# Altium schematic sheet Sch2.SchDoc
size A4; SheetNumber: 2; SheetTotal: 5
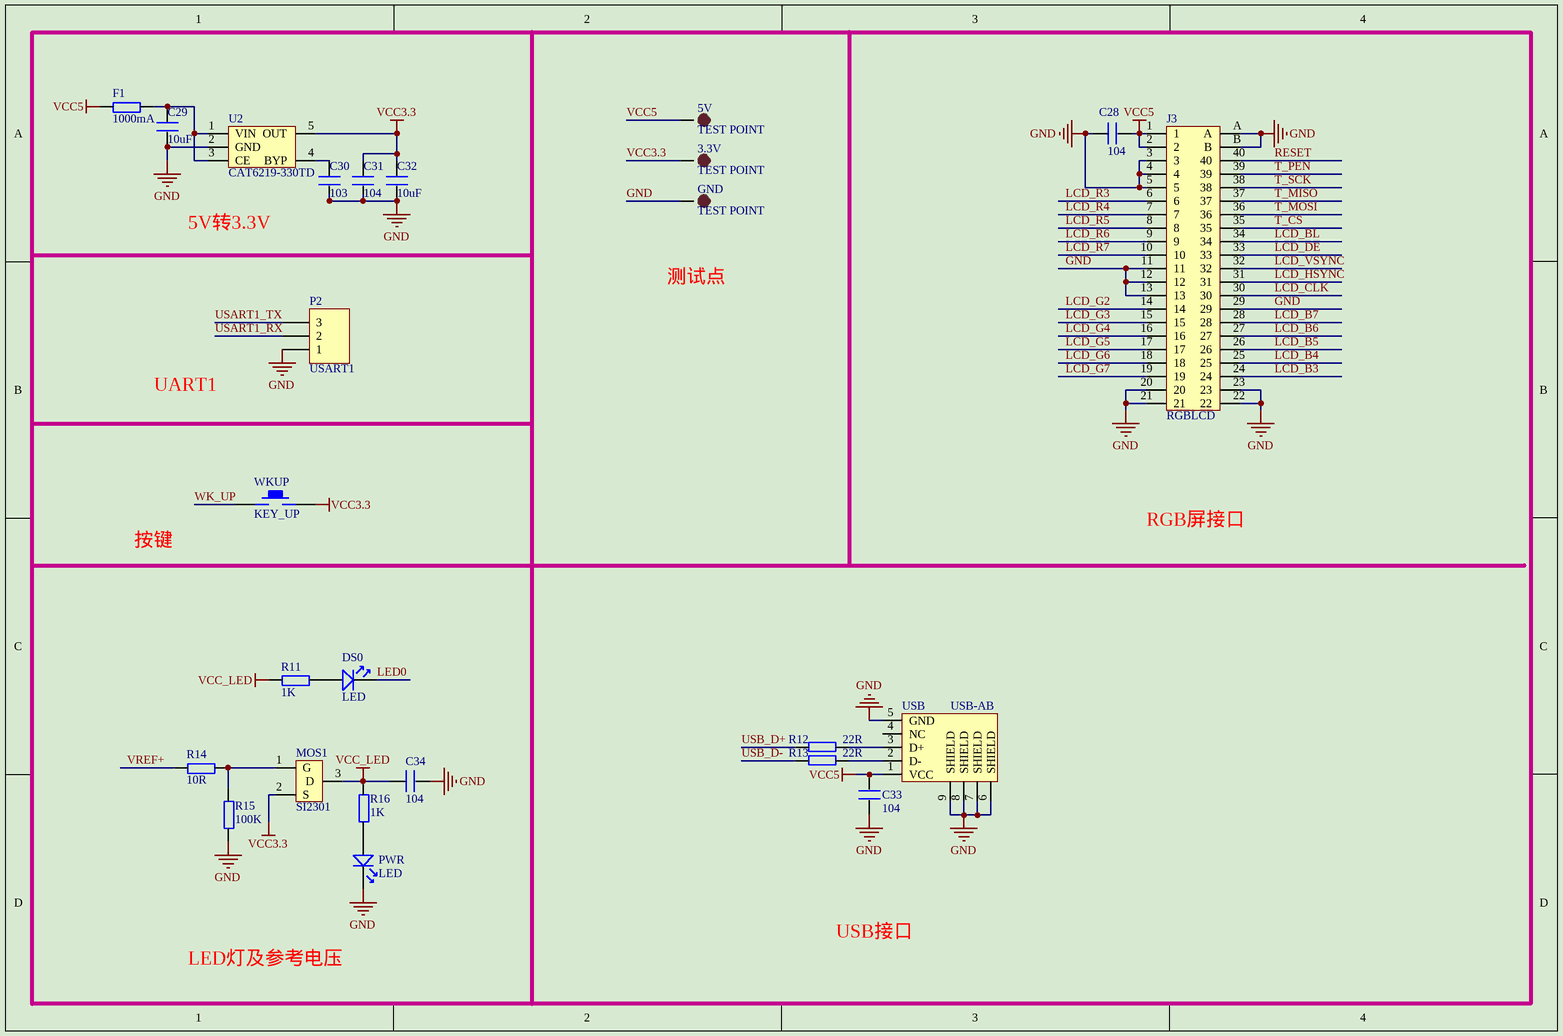
[diagram p0: Sch2.SchDoc]

## Parts
3.3V  TEST POINT  [TP-1.5]
5V  TEST POINT  [TP-1.5]
C28  104  [0402]
C29  10uF  [0603P]
C30  103  [0402]
C31  104  [0402]
C32  10uF  [0603P]
C33  104  [0402]
C34  104  [0402]
DS0  LED  [SMDLED-0603]
F1  1000mA  [0805]
GND  TEST POINT  [TP-1.5]
J3  RGBLCD  [FPC-TOP40]
MOS1  SI2301  [SO-G3/C2.5]
P2  USART1  [HDR1X3]
PWR  LED  [SMDLED-0603]
R11  1K  [0402]
R12  22R  [0402]
R13  22R  [0402]
R14  10R  [0402]
R15  100K  [0402]
R16  1K  [0402]
U2  CAT6219-330TD  [SOT-23-5]
USB  USB-AB  [USB_AB]
WKUP  KEY_UP  [KEY_SOP3625]

## Nets
GND: C28.2 C29.1 C30.1 C31.1 C32.1 C33.2 C34.1 GND.1 J3.3 J3.4 J3.5 J3.11 J3.12 J3.13 J3.20 J3.21 J3.22 J3.23 J3.29 J3.A J3.B P2.1 PWR.2 R15.1 U2.2(GND) USB.5(GND) USB.6(SHIELD) USB.7(SHIELD) USB.8(SHIELD) USB.9(SHIELD)
VCC3.3: 3.3V.1 C31.2 C32.2 MOS1.2(S) U2.5(OUT) WKUP.2
VCC5: 5V.1 C28.1 C33.1 F1.1 J3.1 J3.2 USB.1(VCC)
VCC_LED: C34.2 MOS1.3(D) R11.1 R16.2
LCD_B3: J3.24
LCD_B4: J3.25
LCD_B5: J3.26
LCD_B6: J3.27
LCD_B7: J3.28
LCD_BL: J3.34
LCD_CLK: J3.30
LCD_DE: J3.33
LCD_G2: J3.14
LCD_G3: J3.15
LCD_G4: J3.16
LCD_G5: J3.17
LCD_G6: J3.18
LCD_G7: J3.19
LCD_HSYNC: J3.31
LCD_R3: J3.6
LCD_R4: J3.7
LCD_R5: J3.8
LCD_R6: J3.9
LCD_R7: J3.10
LCD_VSYNC: J3.32
LED0: DS0.2
RESET: J3.40
T_CS: J3.35
T_MISO: J3.37
T_MOSI: J3.36
T_PEN: J3.39
T_SCK: J3.38
USART1_RX: P2.2
USART1_TX: P2.3
USB_D+: R12.2
USB_D-: R13.2
VREF+: R14.1
WK_UP: WKUP.1
NetC29_2: C29.2 F1.2 U2.1(VIN) U2.3(CE)
NetC30_2: C30.2 U2.4(BYP)
NetDS0_1: DS0.1 R11.2
NetMOS1_1: MOS1.1(G) R14.2 R15.2
NetPWR_1: PWR.1 R16.1
NetR12_1: R12.1 USB.3(D+)
NetR13_1: R13.1 USB.2(D-)

Not connected (* = marked no-connect by the designer): USB 4(NC)

## Notes on the sheet
- 5V转3.3V
- 测试点
- UART1
- 按键
- RGB屏接口
- LED灯及参考电压
- USB接口

## Library data of the parts
3.3V 5V GND = TEST-POINT: 测试点
C28-C34 = C
F1 R11-R16 = R
J3 = FPC-40: FPC-40P-0.5mm
MOS1 = MOS-P: IRLML6401/SI2301
P2 = Header 3: Header, 3-Pin; LatestRevisionDate: 17-Jul-2002; LatestRevisionNote: Re-released for DXP Platform.; Publisher: Altium Limited
U2 = CAT6219-330TD: 3.3V 500mA LDO
USB = USB-AB: MicroUSB
WKUP = KEY_M